# EAGLE design MetaSenseV02.1 (EAGLE 7.5.0)
MetaSense AQI Sensing Platform (v2)
DESIGNER: Christine Chan
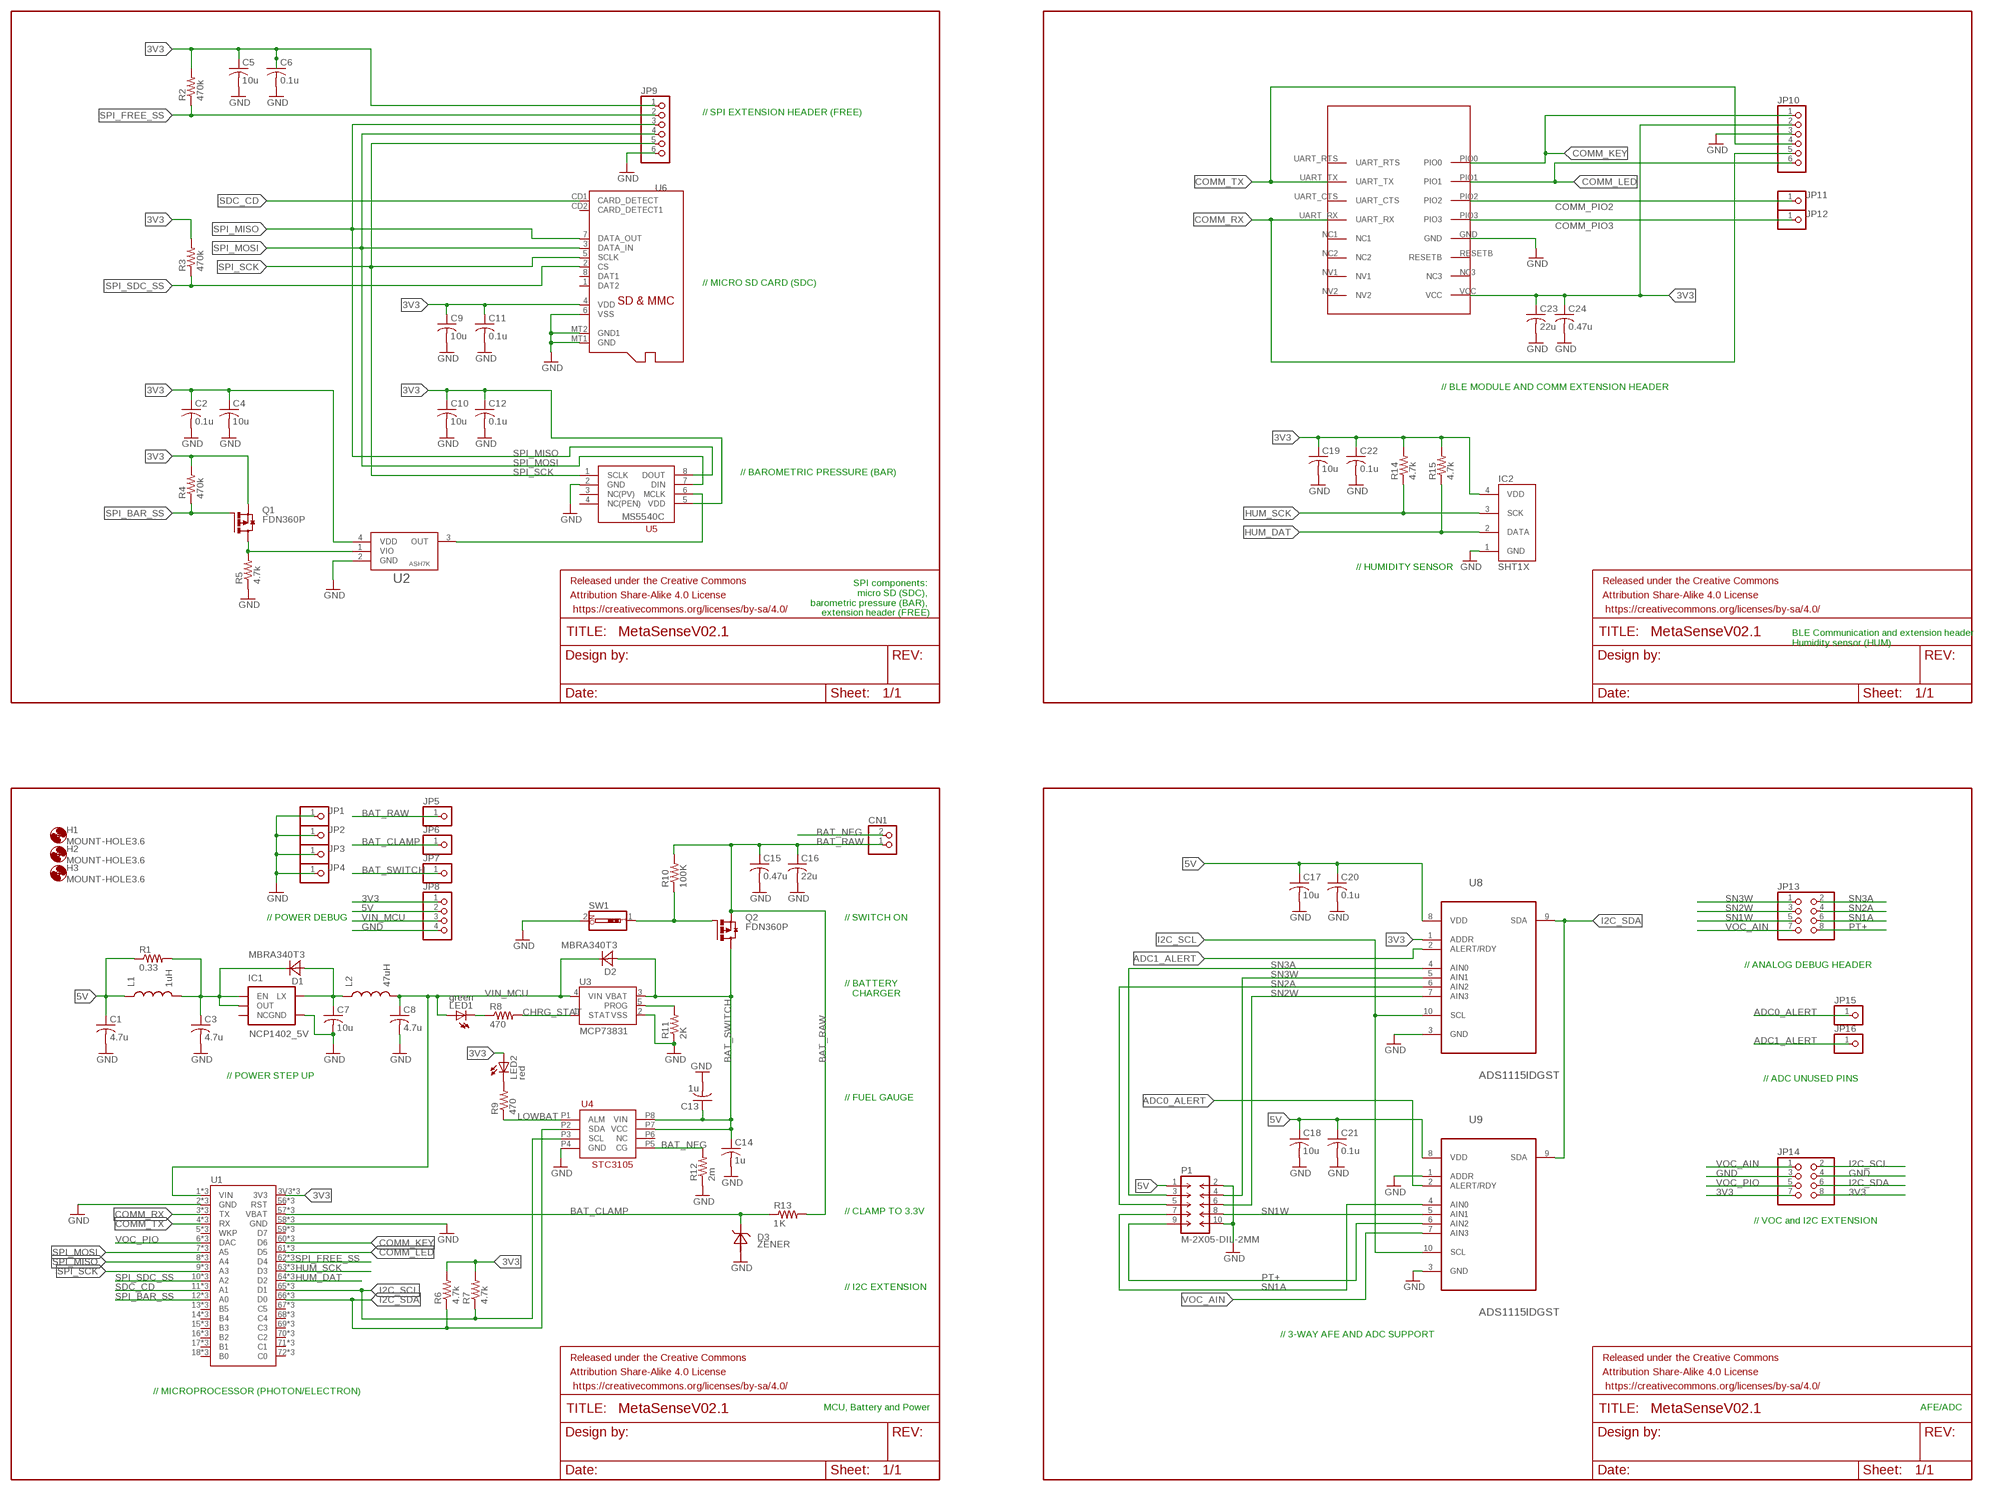
[diagram p0: schematic, sheet 1]

## Parts
C1  4.7u  C-USC0805  [C0805]
C2  0.1u  C-USC0805  [C0805]
C3  4.7u  C-USC0805  [C0805]
C4  10u  C-USC0805  [C0805]
C5  10u  C-USC0805  [C0805]
C6  0.1u  C-USC0805  [C0805]
C7  10u  C-USC0805  [C0805]
C8  4.7u  C-USC0805  [C0805]
C9  10u  C-USC0805  [C0805]
C10  10u  C-USC0805  [C0805]
C11  0.1u  C-USC0805  [C0805]
C12  0.1u  C-USC0805  [C0805]
C13  1u  C-USC0805  [C0805]
C14  1u  C-USC0805  [C0805]
C15  0.47u  C-USC0805  [C0805]
C16  22u  C-USC0805  [C0805]
C17  10u  C-USC0805  [C0805]
C18  10u  C-USC0805  [C0805]
C19  10u  C-USC0805  [C0805]
C20  0.1u  C-USC0805  [C0805]
C21  0.1u  C-USC0805  [C0805]
C22  0.1u  C-USC0805  [C0805]
C23  22u  C-USC0805  [C0805]
C24  0.47u  C-USC0805  [C0805]
CN1  JST_2PIN-THM  [JST-PH-2-THM]
D1  MBRA340T3  [SMA]
D2  MBRA340T3  [SMA]
D3  ZENER  [SOD-123_MINI-SMA]
FRAME1  FRAME-LETTER  [CREATIVE_COMMONS]
FRAME2  FRAME-LETTER  [CREATIVE_COMMONS]
FRAME3  FRAME-LETTER  [CREATIVE_COMMONS]
FRAME4  FRAME-LETTERNO_PACKAGE  [DUMMY]
H1  MOUNT-HOLE3.6  [3,6]
H2  MOUNT-HOLE3.6  [3,6]
H3  MOUNT-HOLE3.6  [3,6]
IC1  NCP1402_5V  V_REG_NCP1400_5V  [SOT23-5]
IC2  SHT1X  [SHT1X]
JP1  PINHD-1X1  [1X01]
JP2  PINHD-1X1  [1X01]
JP3  PINHD-1X1  [1X01]
JP4  PINHD-1X1  [1X01]
JP5  PINHD-1X1  [1X01]
JP6  PINHD-1X1  [1X01]
JP7  PINHD-1X1  [1X01]
JP8  PINHD-1X4  [1X04]
JP9  PINHD-1X6  [1X06]
JP10  PINHD-1X6  [1X06]
JP11  PINHD-1X1  [1X01]
JP12  PINHD-1X1  [1X01]
JP13  PINHD-2X4  [2X04]
JP14  PINHD-2X4  [2X04]
JP15  PINHD-1X1  [1X01]
JP16  PINHD-1X1  [1X01]
L1  1uH  INDUCTOR0805  [0805]
L2  47uH  INDUCTOR0805  [0805]
LED1  green  LEDCHIPLED_0805  [CHIPLED_0805]
LED2  red  LEDCHIPLED_0805  [CHIPLED_0805]
P1  M-2X05-DIL-2MM  [DIL-2MM-2X05]
Q1  FDN360P  [SUPER-SOT3]
Q2  FDN360P  [SUPER-SOT3]
R1  0.33  R-US_R0805  [R0805]
R2  470k  R-US_R0805  [R0805]
R3  470k  R-US_R0805  [R0805]
R4  470k  R-US_R0805  [R0805]
R5  4.7k  R-US_R0805  [R0805]
R6  4.7k  R-US_R0805  [R0805]
R7  4.7k  R-US_R0805  [R0805]
R8  470  R-US_R0805  [R0805]
R9  470  R-US_R0805  [R0805]
R10  100K  R-US_R0805  [R0805]
R11  2K  R-US_R0805  [R0805]
R12  2m  R-US_R0805  [R0805]
R13  1K  R-US_R0805  [R0805]
R14  4.7k  R-US_R0805  [R0805]
R15  4.7k  R-US_R0805  [R0805]
SW1  SW_DIP-1  [EDG-01]
U1  ELECTRONDUALROW  [ELECTRON_DUAL-ROW]
U2  ASH7K-OSCILLATOR  [SMD-4PAD]
U3  MCP73831  [SOT23-5]
U4  STC3105  [TDFN-8-3X2MM]
U5  MS5540CSMD  [SMD-HYBRID]
U6  MICROSD  [MICROSD]
U7  HM-11  [HM-11]
U8  ADS1115IDGST  [SOP50P490X110-10N]
U9  ADS1115IDGST  [SOP50P490X110-10N]

## Nets
3V3: C2.1 C4.1 C5.1 C6.1 C9.1 C10.1 C11.1 C12.1 C19.1 C22.1 C23.1 C24.1 IC2.4(VDD) JP8.1 JP9.1 JP10.2 JP14.7 JP14.8 LED2.A Q1.2(S) R2.2 R3.2 R4.2 R6.2 R7.2 R14.2 R15.2 U1.3V3 U1.55(3V3) U1.91(3V3) U2.4(VDD) U5.5(VDD) U6.4(VDD) U7.VCC U8.1(ADDR)
5V: C1.1 C17.1 C18.1 C20.1 C21.1 JP8.2 L1.1 P1.1 R1.1 U8.8(VDD) U9.8(VDD)
ADC0_ALERT: JP15.1 U9.2(ALERT/RDY)
ADC1_ALERT: JP16.1 U8.2(ALERT/RDY)
BAT_CLAMP: D3.C(CAT) JP6.1 R13.1 U1.57(VBAT) U1.93(VBAT) U1.VBAT
BAT_NEG: CN1.2 R12.2 U4.P5(CG)
BAT_RAW: C15.1 C16.1 CN1.1 JP5.1 Q2.2(S) R10.2 R13.2
BAT_SWITCH: C13.1 C14.1 D2.A JP7.1 Q2.3(D) U3.3(VBAT) U4.P7(VCC) U4.P8(VIN)
CHRG_STAT: R8.2 U3.1(STAT)
COMM_KEY: JP10.1 U1.60(D6) U1.96(D6) U1.D6 U7.PIO0
COMM_LED: JP10.6 U1.61(D5) U1.97(D5) U1.D5 U7.PIO1
COMM_PIO2: JP11.1 U7.PIO2
COMM_PIO3: JP12.1 U7.PIO3
COMM_RX: JP10.5 U1.3(TX) U1.39(TX) U1.TX U7.UART_RX
COMM_TX: JP10.4 U1.4(RX) U1.40(RX) U1.RX U7.UART_TX
GND: C1.2 C2.2 C3.2 C4.2 C5.2 C6.2 C7.2 C8.2 C9.2 C10.2 C11.2 C12.2 C13.2 C14.2 C15.2 C16.2 C17.2 C18.2 C19.2 C20.2 C21.2 C22.2 C23.2 C24.2 D3.A(AN) IC1.4(GND) IC2.1(GND) JP1.1 JP2.1 JP3.1 JP4.1 JP8.4 JP9.6 JP10.3 JP14.3 JP14.4 P1.2 P1.10 R5.1 R11.1 R12.1 SW1.2 U1.2(GND) U1.38(GND) U1.58(GND) U1.94(GND) U1.GND U1.GND@2(GND) U2.2(GND) U3.2(VSS) U4.P4(GND) U5.2(GND) U6.6(VSS) U6.MT1(GND) U6.MT2(GND1) U7.GND U8.3(GND) U9.1(ADDR) U9.3(GND)
HUM_DAT: IC2.2(DATA) R15.1 U1.64(D2) U1.100(D2) U1.D2
HUM_SCK: IC2.3(SCK) R14.1 U1.63(D3) U1.99(D3) U1.D3
I2C_SCL: JP14.2 R7.1 U1.65(D1) U1.101(D1) U1.D1 U4.P3(SCL) U8.10(SCL) U9.10(SCL)
I2C_SDA: JP14.6 R6.1 U1.66(D0) U1.102(D0) U1.D0 U4.P2(SDA) U8.9(SDA) U9.9(SDA)
LOWBAT: R9.1 U4.P1(ALM)
N$1: Q1.3(D) R5.2 U2.1(VIO)
N$2: C3.1 D1.C IC1.1(EN) IC1.2(OUT) L1.2 R1.2
N$3: LED2.C R9.2
N$5: C7.1 D1.A IC1.5(LX) L2.1
N$9: R11.2 U3.5(PROG)
N$11: LED1.C R8.1
N$12: Q2.1(G) R10.1 SW1.1
N$16: U2.3(OUT) U5.6(MCLK)
PT+: JP13.8 P1.9 U9.6(AIN2)
SDC_CD: U1.11(A1) U1.47(A1) U1.A1 U6.CD1(CARD_DETECT)
SN1A: JP13.6 P1.7 U9.4(AIN0)
SN1W: JP13.5 P1.8 U9.5(AIN1)
SN2A: JP13.4 P1.5 U8.6(AIN2)
SN2W: JP13.3 P1.6 U8.7(AIN3)
SN3A: JP13.2 P1.3 U8.4(AIN0)
SN3W: JP13.1 P1.4 U8.5(AIN1)
SPI_BAR_SS: Q1.1(G) R4.1 U1.12(A0) U1.48(A0) U1.A0
SPI_FREE_SS: JP9.2 R2.1 U1.62(D4) U1.98(D4) U1.D4
SPI_MISO: JP9.3 U1.8(A4) U1.44(A4) U1.A4 U5.8(DOUT) U6.7(DATA_OUT)
SPI_MOSI: JP9.4 U1.7(A5) U1.43(A5) U1.A5 U5.7(DIN) U6.3(DATA_IN)
SPI_SCK: JP9.5 U1.9(A3) U1.45(A3) U1.A3 U5.1(SCLK) U6.5(SCLK)
SPI_SDC_SS: R3.1 U1.10(A2) U1.46(A2) U1.A2 U6.2(CS)
VIN_MCU: C8.1 D2.C JP8.3 L2.2 LED1.A U1.1(VIN) U1.37(VIN) U1.VIN U3.4(VIN)
VOC_AIN: JP13.7 JP14.1 U9.7(AIN3)
VOC_PIO: JP14.5 U1.6(DAC) U1.42(DAC) U1.DAC
Unconnected: IC1.3(NC) U1.5(WKP) U1.13(B5) U1.14(B4) U1.15(B3) U1.16(B2) U1.17(B1) U1.18(B0) U1.41(WKP) U1.49(B5) U1.50(B4) U1.51(B3) U1.52(B2) U1.53(B1) U1.54(B0) U1.56(RST) U1.59(D7) U1.67(C5) U1.68(C4) U1.69(C3) U1.70(C2) U1.71(C1) U1.72(C0) U1.92(RST) U1.95(D7) U1.103(C5) U1.104(C4) U1.105(C3) U1.106(C2) U1.107(C1) U1.108(C0) U1.B0 U1.B1 U1.B2 U1.B3 U1.B4 U1.B5 U1.C0 U1.C1 U1.C2 U1.C3 U1.C4 U1.C5 U1.D7 U1.RST U1.WKP U4.P6(NC) U5.3(NC(PV)) U5.4(NC(PEN)) U6.1(DAT2) U6.8(DAT1) U6.CD2(CARD_DETECT1) U7.NC1 U7.NC2 U7.NC3 U7.NV1 U7.NV2 U7.RESETB U7.UART_CTS U7.UART_RTS

## Notes on the sheet
- // SPI EXTENSION HEADER (FREE)
- // MICRO SD CARD (SDC)
- // BLE MODULE AND COMM EXTENSION HEADER
- // BAROMETRIC PRESSURE (BAR)
- // HUMIDITY SENSOR
- SPI components: 
  micro SD (SDC), 
  barometric pressure (BAR), 
  extension header (FREE)
- BLE Communication and extension header
  Humidity sensor (HUM)
- // POWER DEBUG | // SWITCH ON
- // ANALOG DEBUG HEADER
- // BATTERY 
     CHARGER
- // POWER STEP UP
- // ADC UNUSED PINS
- // FUEL GAUGE
- // CLAMP TO 3.3V
- // VOC and I2C EXTENSION
- // I2C EXTENSION
- // 3-WAY AFE AND ADC SUPPORT
- // MICROPROCESSOR (PHOTON/ELECTRON)
- MCU, Battery and Power | AFE/ADC

## Library data of the parts
C1 C3 C8 = adafruit:C-US: CAPACITOR, American symbol; MF: VISHAY/DALE; MPN: IHLP2525CZER4R7M01; OC_NEWARK: 53K4859
C2 C6 C11 C12 C20-C22 = adafruit:C-US: CAPACITOR, American symbol; MF: KEMET; MPN: C0603C102J5GACTU; OC_NEWARK: 02J8136
C4 C5 C7 C9 C10 C17-C19 = adafruit:C-US: CAPACITOR, American symbol; MPN: C0805C106Z8VACTU; OC_NEWARK: 76Y2954
C13-C15 C24 = adafruit:C-US: CAPACITOR, American symbol; MF: KEMET; MPN: C0402C471K5RACTU; OC_NEWARK: 88C9981
C16 C23 = adafruit:C-US: CAPACITOR, American symbol; OC_NEWARK: unknown
CN1 = adafruit:JST_2PIN: JST 2-Pin Connectors of various flavors SMT-RA (S2B-PH-SM4) 4UConnector #17311 SMT (B2B-PH-SM4) THM-RA (S2B-PH) THM (B2B-PH); OC_NEWARK: unknown
D1 D2 = diode:MBRA340T3: Surface Mount Schottky Power Rectifier Source: http://www.onsemi.com/pub_link/Collateral/MBRA340T3-D.PDF; OC_NEWARK: unknown
D3 = metasense:ZENER; OC_NEWARK: unknown
FRAME1-FRAME3 = SparkFun-Aesthetics:FRAME-LETTER: Schematic Frame Standard 8.5x11 US Letter frame; OC_NEWARK: unknown
FRAME4 = SparkFun-Aesthetics:FRAME-LETTER: Schematic Frame Standard 8.5x11 US Letter frame; DESIGNER: Christine Chan; OC_NEWARK: unknown; VERSION: v02
H1-H3 = holes:MOUNT-HOLE: MOUNTING HOLE with drill center marker; OC_NEWARK: unknown
IC1 = SparkFun-PowerIC:V_REG_NCP1400: Switching step-up voltage regulator NCP1400 switiching regulator takes single cell AA and outputs 100mA at 3.3V or 5V with minimal number of external components.; MF: ON SEMICONDUCTOR; MPN: NCP1402SN50T1G; OC_NEWARK: 98H0882; PROD_ID: IC-10787; VALUE: 5.0v
IC2 = sht10_11_15:SHT1X; MF: SENSIRION AG; MPN: SHT11; OC_NEWARK: 69C4848
JP1-JP7 JP11 JP12 = pinhead:PINHD-1X1: PIN HEADER; OC_NEWARK: unknown
JP8 = pinhead:PINHD-1X4: PIN HEADER; OC_NEWARK: unknown
JP9 JP10 = adafruit:PINHD-1X6: PIN HEADER; OC_NEWARK: unknown
JP13 JP14 = adafruit:PINHD-2X4: PIN HEADER; OC_NEWARK: unknown
JP15 JP16 = adafruit:PINHD-1X1: Pin header 1x1 for 0.1" spacing With round pins; OC_NEWARK: unknown
L1 = SparkFun-Passives:INDUCTOR: Inductors Basic Inductor/Choke - 0603 and 1206. Footprints are not proven and vary greatly between part numbers. INDUCTOR POWER 3.3UH 4.0A SMD 0.197" L x 0.197" W x 0.177" H (5.00mm x 5.00mm x 4.50mm); MPN: LQM21NN1R0K10D; OC_NEWARK: 97K3787
L2 = SparkFun-Passives:INDUCTOR: Inductors Basic Inductor/Choke - 0603 and 1206. Footprints are not proven and vary greatly between part numbers. INDUCTOR POWER 3.3UH 4.0A SMD 0.197" L x 0.197" W x 0.177" H (5.00mm x 5.00mm x 4.50mm); OC_NEWARK: unknown
LED1 = adafruit:LED: LED OSRAM: - CHIPLED LG R971, LG N971, LY N971, LG Q971, LY Q971, LO R971, LY R971 LH N974, LH R974 LS Q976, LO Q976, LY Q976 LO Q996 - Hyper CHIPLED LW Q18S LB Q993, LB Q99A, LB R99A - SideLED LS A670, LO A670, LY A670, LG A670, LP A670 LB A673, LV A673, LT A673, LW A673 LH A674 LY A675 LS A676, LA A676, LO A676, LY A676, LW A676 LS A679, LY A679, LG A679 - Hyper Micro SIDELED® LS Y876, LA Y876, LO Y876, LY Y876 LT Y87S - SmartLED LW L88C, LW L88S LB L89C, LB L89S, LG L890 LS L89K, LO L89K, LY L89K LS L896, LA L896, LO L896, LY L896 - TOPLED LS T670, LO T670, LY T670, LG T670, LP T670 LSG T670, LSP T670, LSY T670, LOP T670, LYG T670 LG T671, LOG T671, LSG T671 LB T673, LV T673, LT T673, LW T673 LH T674 LS T676, LA T676, LO T676, LY T676, LB T676, LH T676, LSB T676, LW T676 LB T67C, LV T67C, LT T67C, LS T67K, LO T67K, LY T67K, LW E67C LS E67B, LA E67B, LO E67B, LY E67B, LB E67C, LV E67C, LT E67C LW T67C LS T679, LY T679, LG T679 LS T770, LO T770, LY T770, LG T770, LP T770 LB T773, LV T773, LT T773, LW T773 LH T774 LS E675, LA E675, LY E675, LS T675 LS T776, LA T776, LO T776, LY T776, LB T776 LHGB T686 LT T68C, LB T68C - Hyper Mini TOPLED® LB M676 - Mini TOPLED Santana® LG M470 LS M47K, LO M47K, LY M47K Source: http://www.osram.convergy.de/; MPN: NTE30003; OC_NEWARK: 32M3086
LED2 = adafruit:LED: LED OSRAM: - CHIPLED LG R971, LG N971, LY N971, LG Q971, LY Q971, LO R971, LY R971 LH N974, LH R974 LS Q976, LO Q976, LY Q976 LO Q996 - Hyper CHIPLED LW Q18S LB Q993, LB Q99A, LB R99A - SideLED LS A670, LO A670, LY A670, LG A670, LP A670 LB A673, LV A673, LT A673, LW A673 LH A674 LY A675 LS A676, LA A676, LO A676, LY A676, LW A676 LS A679, LY A679, LG A679 - Hyper Micro SIDELED® LS Y876, LA Y876, LO Y876, LY Y876 LT Y87S - SmartLED LW L88C, LW L88S LB L89C, LB L89S, LG L890 LS L89K, LO L89K, LY L89K LS L896, LA L896, LO L896, LY L896 - TOPLED LS T670, LO T670, LY T670, LG T670, LP T670 LSG T670, LSP T670, LSY T670, LOP T670, LYG T670 LG T671, LOG T671, LSG T671 LB T673, LV T673, LT T673, LW T673 LH T674 LS T676, LA T676, LO T676, LY T676, LB T676, LH T676, LSB T676, LW T676 LB T67C, LV T67C, LT T67C, LS T67K, LO T67K, LY T67K, LW E67C LS E67B, LA E67B, LO E67B, LY E67B, LB E67C, LV E67C, LT E67C LW T67C LS T679, LY T679, LG T679 LS T770, LO T770, LY T770, LG T770, LP T770 LB T773, LV T773, LT T773, LW T773 LH T774 LS E675, LA E675, LY E675, LS T675 LS T776, LA T776, LO T776, LY T776, LB T776 LHGB T686 LT T68C, LB T68C - Hyper Mini TOPLED® LB M676 - Mini TOPLED Santana® LG M470 LS M47K, LO M47K, LY M47K Source: http://www.osram.convergy.de/; MPN: NTE30002; OC_NEWARK: 32M3085
P1 = con-headers-jp:M-2X05-: MALE HEADER; OC_NEWARK: unknown
Q1 Q2 = transistor-power:FDN360P: Single P-Channel, PowerTrench (R) MOSFET Source: http://www.fairchildsemi.com/ds/FD/FDN360P.pdf; MF: FAIRCHILD SEMICONDUCTOR; MPN: FDN360P; OC_NEWARK: 58K1466
R1 R8 R9 R11 R12 = adafruit:R-US_: RESISTOR, American symbol; OC_NEWARK: unknown
R2-R4 = adafruit:R-US_: RESISTOR, American symbol; MF: VISHAY/DALE; MPN: CRCW0805470KJNEA; OC_NEWARK: 28K0214
R5-R7 R14 R15 = adafruit:R-US_: RESISTOR, American symbol; MF: VISHAY/DALE; MPN: CRCW08054K70JNEA; OC_NEWARK: 01H7096
R10 = adafruit:R-US_: RESISTOR, American symbol; MPN: ERA-6AEB104V; OC_NEWARK: 08N2143
R13 = adafruit:R-US_: RESISTOR, American symbol; MPN: ERJ-6ENF1001V; OC_NEWARK: 64R5369
SW1 = special:SW_DIP-1: DIP SWITCH; OC_NEWARK: unknown
U1 = Particle:ELECTRON; OC_NEWARK: unknown
U2 = metasense:ASH7K-OSCILLATOR; OC_NEWARK: unknown
U3 = SparkFun-PowerIC:MCP73831: Miniature single cell, fully integrated Li-Ion, Li-polymer charge management controller http://ww1.microchip.com/downloads/en/DeviceDoc/20001984g.pdf IC-09995; MPN: MCP73831T-2DCI/OT; OC_NEWARK: 84R6271; PROD_ID: IC-09995
U4 = metasense:STC3105
U5 = metasense:MS5540C; OC_NEWARK: unknown
U6 = metasense:MICROSD: Micro-SD / Transflash card holder with SPI pinout For the 3M # 2908-05WB-MG and/or 4UCON #19656 push-push type; MPN: 2908-05WB-MG; OC_NEWARK: 28M0115
U7 = HM-11:HM-11; OC_NEWARK: unknown
U8 U9 = Texas Instruments_By_element14_Batch_1:ADS1115IDGST: Analog-to-Digital Converter with Internal Reference; MPN: ADS1115IDGST; OC_FARNELL: 1762981; OC_NEWARK: 25R1241; PACKAGE: MSOP-10; SUPPLIER: Texas Instruments

## Board
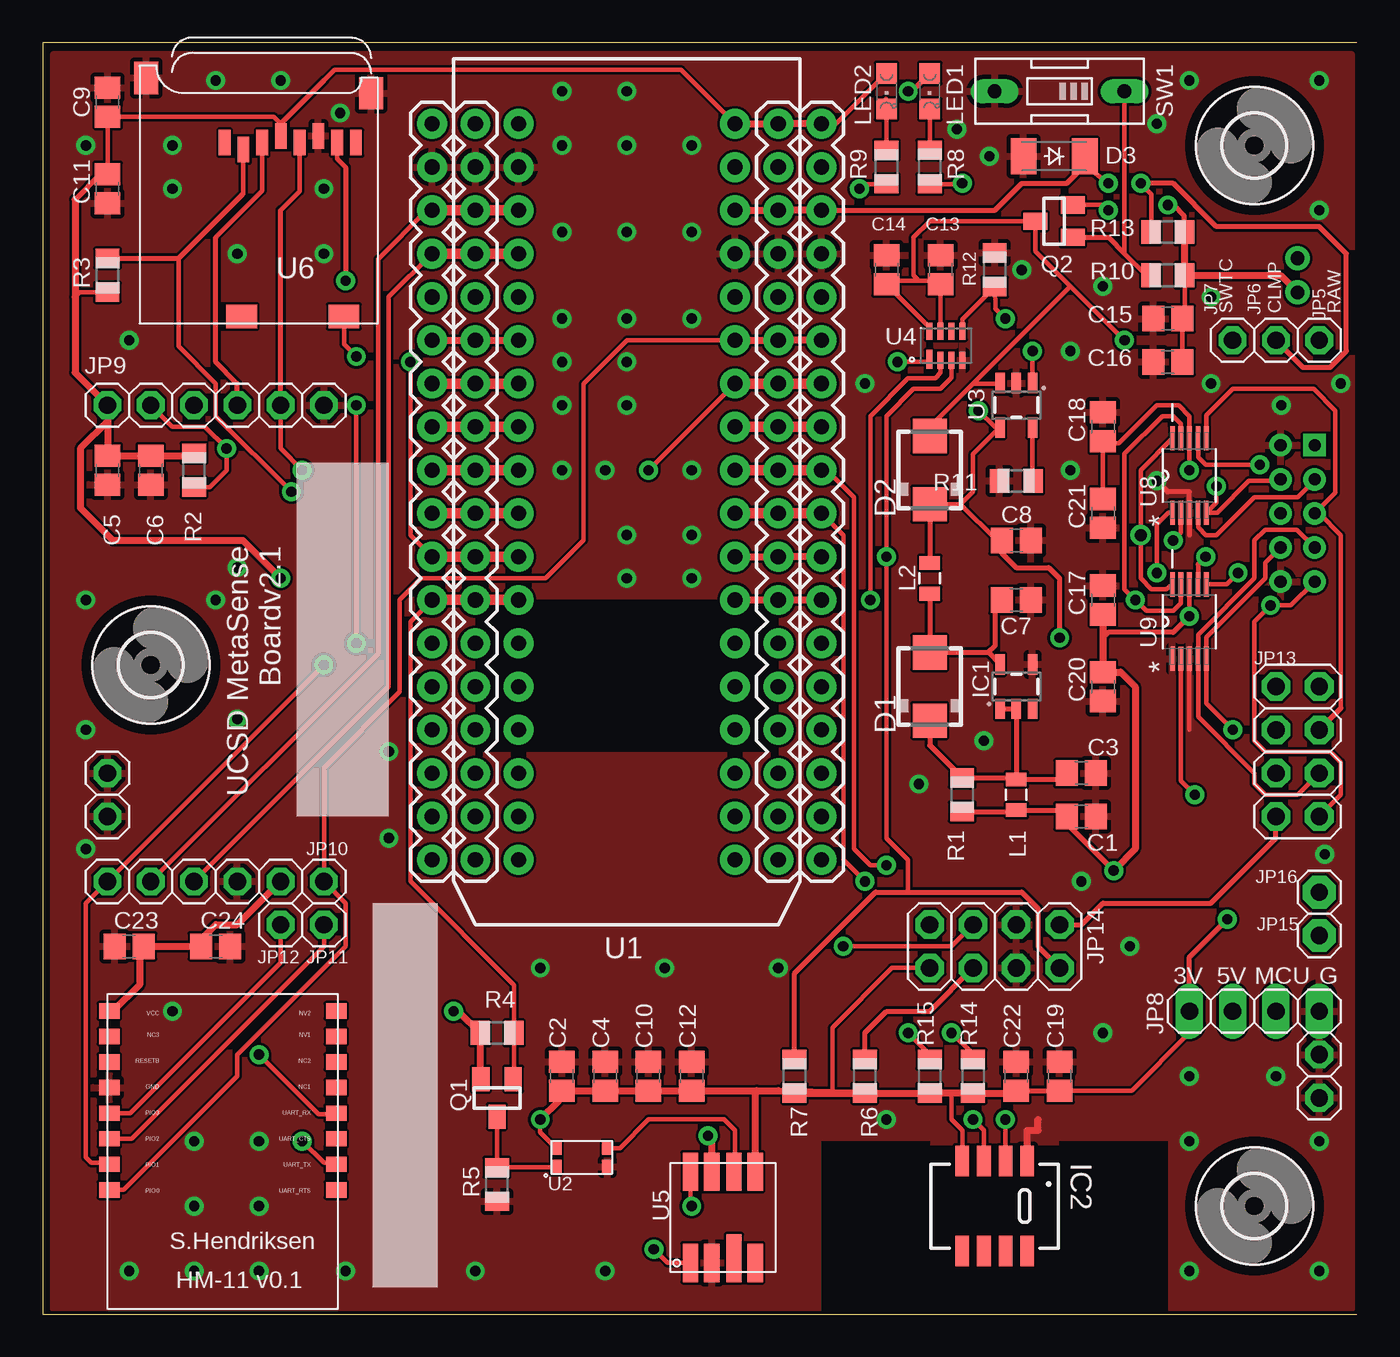
[diagram p1: board, top side]
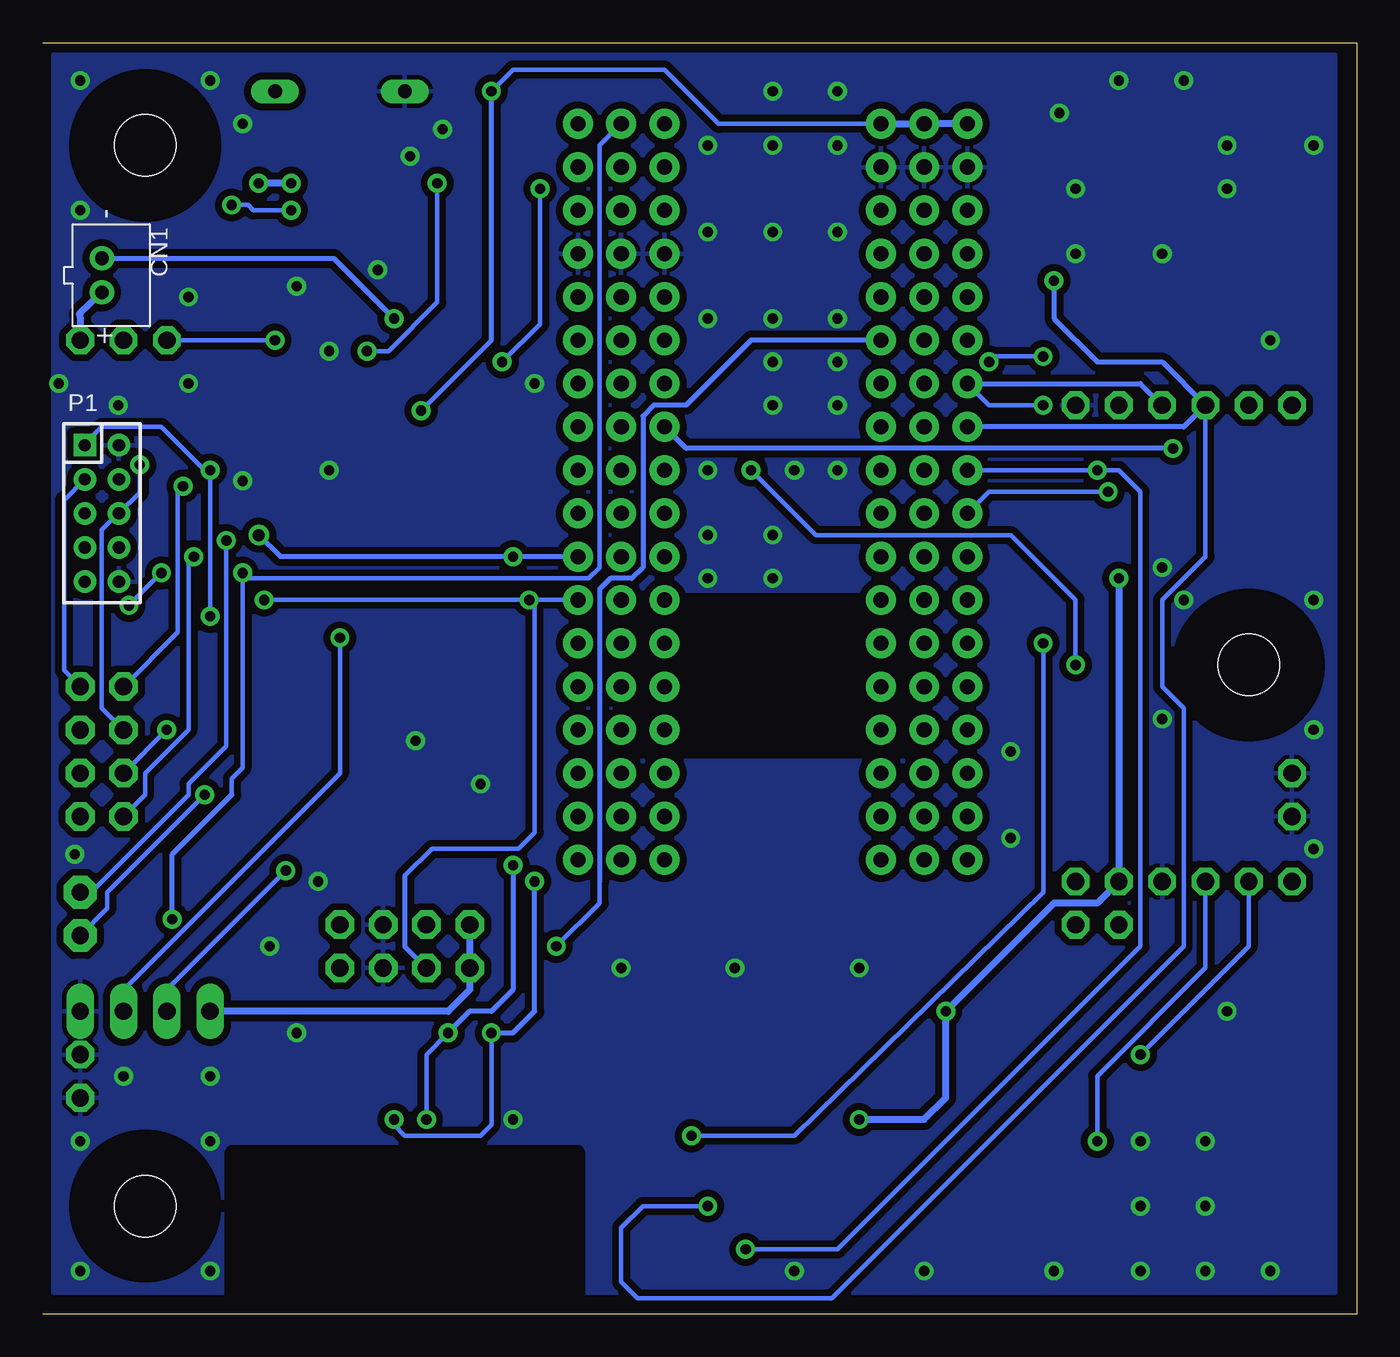
[diagram p2: board, bottom side, seen from below]

Size 77.14 x 74.61 mm. Coordinates in mm from the lower left corner, seen from the top.
Outline: 77.14,0 0,0 0,74.61 77.14,74.6
Copper layers (1*16): Top 0.035mm / dielectric 1.5mm / Bottom 0.035mm
Design rules "SparkFun *": minimum track width 8mil, minimum drill 20mil, track to track 6mil, track to pad 7mil, pad to pad 7mil, via to via 6mil, smd to smd 6mil, copper to edge 8mil, drill to drill 8mil, minimum pad ring 12mil, minimum via ring 10mil, stop-mask expansion 6mil, vias tented up to drill 20mil, thermal gap 10mil
tRestrict: area 25.4,33 to 43.2,41.9; area 45.7,-1.3 to 52.1,10.2; area 59.7,-1.3 to 66,10.2; area 45.7,-1.3 to 66,2.5
bRestrict: area 25.4,33 to 43.2,41.9; area 45.7,0.6 to 66,9.5

### Footprints (pad centres in the part's own frame; a part is rotated, then mirrored left to right if it is on the bottom)
C0805 = smd 1.3 x 1.5: 1 -0.85,0; 2 0.85,0
JST-PH-2-THM = drill 0.8 pad 1.422: 1 1,0; 2 -1,0
SMA = smd 2 x 2: A 2,0; C -2,0
SOD-123_MINI-SMA = smd 1.5 x 2.1: A 1.8,0; C -1.8,0
3,6 = hole 3.6: 0,0
SOT23-5 = smd 0.55 x 1.2: 1 -0.95,-1.3; 2 0,-1.3; 3 0.95,-1.3; 4 0.95,1.3; 5 -0.95,1.3
SHT1X = smd 1.803 x 0.8: 1 -2.642,1.905; 2 -2.642,0.635; 3 -2.642,-0.635; 4 -2.642,-1.905; 5 2.642,-1.905; 6 2.642,-0.635; 7 2.642,0.635; 8 2.642,1.905
1X01 = drill 1.016 octagon: 1 0,0
1X04 = drill 1.016 long: 1 -3.81,0; 2 -1.27,0; 3 1.27,0; 4 3.81,0
1X06 = drill 1.016 octagon: 1 -6.35,0; 2 -3.81,0; 3 -1.27,0; 4 1.27,0; 5 3.81,0; 6 6.35,0
2X04 = drill 1.016 pad 1.676 octagon: 1 -3.81,-1.27; 2 -3.81,1.27; 3 -1.27,-1.27; 4 -1.27,1.27; 5 1.27,-1.27; 6 1.27,1.27; 7 3.81,-1.27; 8 3.81,1.27
1X01' = drill 1.016 pad 1.93 octagon: 1 0,0
0805 = smd 0.8 x 1.2: 1 -0.9,0; 2 0.9,0
CHIPLED_0805 = smd 1.2 x 1.2: A 0,-1.05; C 0,1.05
DIL-2MM-2X05 = drill 0.711 square: 1 -4,-1 | drill 0.711: 2 -4,1; 3 -2,-1; 4 -2,1; 5 0,-1; 6 0,1; 7 2,-1; 8 2,1; 9 4,-1; 10 4,1
SUPER-SOT3 = smd 1 x 1.4: 1 -0.95,-1.1; 2 0.95,-1.1; 3 0,1.1
R0805 = smd 1.1 x 1.4: 1 -1,0; 2 1,0
EDG-01 = drill 0.813 long: 1 0,-3.81; 2 0,3.81
ELECTRON_DUAL-ROW = drill 0.889 pad 1.753: 1 1.27,2.54; 2 3.81,2.54; 3 6.35,2.54; 3V3 1.27,22.86; 4 8.89,2.54; 5 11.43,2.54; 6 13.97,2.54; 7 16.51,2.54; 8 19.05,2.54; 9 21.59,2.54; 10 24.13,2.54; 11 26.67,2.54; 12 29.21,2.54; 13 31.75,2.54; 14 34.29,2.54; 15 36.83,2.54; 16 39.37,2.54; 17 41.91,2.54; 18 44.45,2.54; 37 1.27,7.62; 38 3.81,7.62; 39 6.35,7.62; 40 8.89,7.62; 41 11.43,7.62; 42 13.97,7.62; 43 16.51,7.62; 44 19.05,7.62; 45 21.59,7.62; 46 24.13,7.62; 47 26.67,7.62; 48 29.21,7.62; 49 31.75,7.62; 50 34.29,7.62; 51 36.83,7.62; 52 39.37,7.62; 53 41.91,7.62; 54 44.45,7.62; 55 1.27,20.32; 56 3.81,20.32; 57 6.35,20.32; 58 8.89,20.32; 59 11.43,20.32; 60 13.97,20.32; 61 16.51,20.32; 62 19.05,20.32; 63 21.59,20.32; 64 24.13,20.32; 65 26.67,20.32; 66 29.21,20.32; 67 31.75,20.32; 68 34.29,20.32; 69 36.83,20.32; 70 39.37,20.32; 71 41.91,20.32; 72 44.45,20.32; 91 1.27,25.4; 92 3.81,25.4; 93 6.35,25.4; 94 8.89,25.4; 95 11.43,25.4; 96 13.97,25.4; 97 16.51,25.4; 98 19.05,25.4; 99 21.59,25.4; 100 24.13,25.4; 101 26.67,25.4; 102 29.21,25.4; 103 31.75,25.4; 104 34.29,25.4; 105 36.83,25.4; 106 39.37,25.4; 107 41.91,25.4; 108 44.45,25.4; A0 29.21,5.08; A1 26.67,5.08; A2 24.13,5.08; A3 21.59,5.08; A4 19.05,5.08; A5 16.51,5.08; B0 44.45,5.08; B1 41.91,5.08; B2 39.37,5.08; B3 36.83,5.08; B4 34.29,5.08; B5 31.75,5.08; C0 44.45,22.86; C1 41.91,22.86; C2 39.37,22.86; C3 36.83,22.86; C4 34.29,22.86; C5 31.75,22.86; D0 29.21,22.86; D1 26.67,22.86; D2 24.13,22.86; D3 21.59,22.86; D4 19.05,22.86; D5 16.51,22.86; D6 13.97,22.86; D7 11.43,22.86; DAC 13.97,5.08; GND 8.89,22.86; GND@2 3.81,5.08; RST 3.81,22.86; RX 8.89,5.08; TX 6.35,5.08; VBAT 6.35,22.86; VIN 1.27,5.08; WKP 11.43,5.08
SMD-4PAD = smd 0.6 x 0.8: 1 0.3,0.4; 2 3.3,0.4; 3 3.3,1.5; 4 0.3,1.5
TDFN-8-3X2MM = smd 0.35 x 1.1: P1 -0.975,-0.8 | smd 0.35 x 1: P2 -0.325,-0.85; P3 0.325,-0.85; P4 0.975,-0.85; P5 0.975,0.85; P6 0.325,0.85; P7 -0.325,0.85; P8 -0.975,0.85
SMD-HYBRID = smd 2.25 x 0.9: 1 5.875,1.2; 2 5.875,2.45; 4 5.875,5; 5 0.525,5; 6 0.525,3.75; 7 0.525,2.45; 8 0.525,1.2 | smd 2.8 x 0.9: 3 5.6,3.75
MICROSD = smd 0.7 x 1.5: 1 9,-10.64; 2 7.9,-10.24; 3 6.8,-10.64; 4 5.7,-11.04; 5 4.6,-10.64; 6 3.5,-11.04; 7 2.4,-10.64; 8 1.3,-10.64 | smd 1.8 x 1.4: CD1 2,-0.44; CD2 8,-0.44 | smd 1.4 x 1.9: MT1 0.4,-13.54; MT2 13.6,-14.44
HM-11 = smd 1.2 x 0.9: GND 7.508,-0.6; NC1 -5.808,-0.6; NC2 -5.808,-2.1; NC3 7.508,-3.6; NV1 -5.808,-3.6; NV2 -5.808,-5.1; PIO0 7.508,5.4; PIO1 7.508,3.9; PIO2 7.508,2.4; PIO3 7.508,0.9; RESETB 7.508,-2.1; UART_CTS -5.808,2.4; UART_RTS -5.808,5.4; UART_RX -5.808,0.9; UART_TX -5.808,3.9; VCC 7.508,-5.1
SOP50P490X110-10N = smd 1.422 x 0.279: 1 -2.184,0.991; 2 -2.184,0.508; 3 -2.184,0; 4 -2.184,-0.508; 5 -2.184,-0.991; 6 2.184,-0.991; 7 2.184,-0.508; 8 2.184,0; 9 2.184,0.508; 10 2.184,0.991

### Placement (x,y rotation side)
C1  60.96,29.21 0 top
C2  30.48,13.97 90 top
C3  60.96,31.75 0 top
C4  33.02,13.97 90 top
C5  3.81,49.53 270 top
C6  6.35,49.53 270 top
C7  57.15,41.91 0 top
C8  57.15,45.4 0 top
C9  3.81,71.12 90 top
C10  35.56,13.97 90 top
C11  3.81,66.04 270 top
C12  38.1,13.97 90 top
C13  52.7,61.28 90 top
C14  49.53,61.28 90 top
C15  66.04,58.42 180 top
C16  66.04,55.88 180 top
C17  62.23,41.91 90 top
C18  62.23,52.07 90 top
C19  59.69,13.97 90 top
C20  62.23,36.83 270 top
C21  62.23,46.99 270 top
C22  57.15,13.97 90 top
C23  5.08,21.59 180 top
C24  10.16,21.59 0 top
CN1  73.66,60.96 270 bottom
D1  52.07,36.83 90 top
D2  52.07,49.53 90 top
D3  59.37,67.94 180 top
FRAME1  16.51,-12.7 0 top  (outside the outline)
FRAME2  16.51,-12.7 0 top  (outside the outline)
FRAME3  16.51,-12.7 0 top  (outside the outline)
FRAME4  2.54,-10.16 0 top  (outside the outline)
H1  71.12,68.58 0 top
H2  71.12,6.35 0 top
H3  6.35,38.1 0 top
IC1  57.15,36.83 0 top
IC2  55.88,6.35 270 top
JP1  3.81,31.75 0 top
JP2  3.81,29.21 0 top
JP3  74.93,15.24 0 top
JP4  74.93,12.7 0 top
JP5  74.93,57.15 0 top
JP6  72.39,57.15 0 top
JP7  69.85,57.15 0 top
JP8  71.12,17.78 0 top
JP9  10.16,53.34 0 top
JP10  10.16,25.4 180 top
JP11  16.51,22.86 0 top
JP12  13.97,22.86 0 top
JP13  73.66,33.02 270 top
JP14  55.88,21.59 180 top
JP15  [1X01']  74.93,22.23 0 top
JP16  [1X01']  74.93,24.77 0 top
L1  57.15,30.48 90 top
L2  52.07,43.18 90 top
LED1  52.07,71.75 180 top
LED2  49.53,71.75 180 top
P1  73.66,46.99 270 bottom
Q1  26.67,12.7 180 top
Q2  59.37,64.14 90 top
R1  53.98,30.48 90 top
R2  8.89,49.53 90 top
R3  3.81,60.96 270 top
R4  26.67,16.51 180 top
R5  26.67,7.62 90 top
R6  48.26,13.97 270 top
R7  44.13,13.97 270 top
R8  52.07,67.31 270 top
R9  49.53,67.31 90 top
R10  66.04,60.96 0 top
R11  57.15,48.9 0 top
R12  55.88,61.28 270 top
R13  66.04,63.5 0 top
R14  54.61,13.97 270 top
R15  52.07,13.97 270 top
SW1  59.69,71.75 90 top
U1  20.32,71.12 270 top
U2  29.84,8.26 0 top
U3  57.15,53.34 180 top
U4  53.02,56.83 0 top
U5  36.83,8.89 270 top
U6  19.68,58.1 180 top
U7  11.43,12.7 180 top
U8  67.31,49.21 90 top
U9  67.31,40.64 90 top

### Tracks (layer width: path | path; a pad name or v marks a point on that pad's centre or on a via)
3V3  (via drill 0.6)
  Top 0.254: 57.15,12.7 C22.1 57,12.97 | R3.2 2.17,59.96 1.91,59.69 | 8.74,50.38 R2.2 | 25.72,16.46 R4.2 25.7,16.69 | 30.28,13.03 C2.1 | IC2.4 53.98,10.79 53.34,11.43 53.34,12.97 | C19.1 63.92,13.12 67.31,16.51 JP8.1 | U8.1 66.08,47.03 65.41,46.35 v65.41,43.5 | v29.21,11.43 29.21,10.69 U2.4 | C11.1 C9.1 13.55,70.27 13.97,69.85 13.97,69.16 U6.4 | 16.51,72.39 17.14,73.03 37.47,73.03 U1.55 | JP14.8 49.85,20.32 46.35,16.83 46.35,13.02 | U1.91 46.58,69.85 LED2.A
  Top 0.305: C22.1 C19.1 | C11.1 3.39,66.89 1.91,65.41 | U6.4 13.98,69.86 16.51,72.39 | JP8.1 67.31,20.95 v69.53,23.18
  Top 0.406: 57,12.97 R14.2 53.34,12.97 R15.2 R7.2 R6.2 43.18,13.12 41.91,13.12 | 1.91,65.41 1.91,59.69 1.91,55.24 JP9.1 | JP9.1 C5.1 C6.1 8.74,50.38 | C2.1 C4.1 C10.1 C12.1 41.91,13.12 | Q1.2 25.72,16.46 | U1.55 U1.3V3 U1.91 | U7.VCC 4.15,17.8 5.71,19.37 5.71,21.38 C23.1 C24.1 9.31,22.01 10.16,22.86 11.43,22.86 JP10.2 | U5.5 41.83,13.04 41.91,13.12 | v24.13,17.78 24.4,17.78 R4.2 | 30.28,13.03 30.28,12.5 v29.21,11.43 | JP9.1 3.81,52.39 2.22,50.8 2.22,47.31 4.13,45.4 11.75,45.4 v13.97,43.18
  Bottom 0.254: 66.04,30.48 66.04,31.43 65.41,32.07 v65.41,43.5 65.09,43.18 45.09,43.18 44.45,43.81 44.45,68.58 U1.3V3
  Bottom 0.305: v69.53,23.18 69.53,26.99 66.04,30.48
  Bottom 0.406: JP10.2 15.24,24.13 17.78,24.13 v24.13,17.78 24.13,12.7 25.4,11.43 v29.21,11.43 | v13.97,43.18 13.97,25.72 14.29,25.4 | JP8.1 53.34,17.78 52.07,19.05 JP14.8 JP14.7
5V  (via drill 0.6)
  Top 0.254: C21.1 C18.1 62.33,51.12 63.18,51.12 65.41,53.34 66.67,53.34 67.31,52.7 U8.8 v67.31,49.53 | U9.8 v67.31,40.96
  Top 0.305: v67.31,40.96 66.36,40.01 62.55,40.01 62.23,39.69 | R1.1 57.05,29.48 L1.1 59.74,29.58 C1.1 60.11,28.79 v62.87,26.04
  Top 0.406: C17.1 62.23,39.69 C20.1 63.28,37.68 64.14,36.83 64.14,27.3 v62.87,26.04
  Bottom 0.254: P1.1 74.66,51.07 73.66,52.07 70.17,52.07 67.63,49.53 v67.31,49.53 v67.31,40.96 | JP8.2 69.85,19.05 v62.87,26.04
ADC0_ALERT  (via drill 0.6)
  Top 0.254: U9.2 66.8,31.3 v67.63,30.48
  Bottom 0.254: v67.63,30.48 73.34,24.77 73.34,23.81 JP15.1
ADC1_ALERT  (via drill 0.6)
  Top 0.254: U8.2 66.8,45.85 v66.36,45.4
  Bottom 0.254: v66.36,45.4 66.36,33.34 68.58,31.11 68.58,30.48 74.3,24.77 JP16.1
BAT_CLAMP  (via drill 0.6)
  Top 0.254: 64.77,63.77 R13.1 65.09,63.55 65.09,65.72 v64.45,66.36
  Top 0.305: U1.93 55.88,64.77 57.47,66.36 60.12,66.36 61.17,67.42 | D3.C 61.17,67.42 | 61.17,67.42 v62.55,66.36 | JP6.1 73.98,55.56 75.56,55.56 76.52,56.52 76.52,62.23 74.93,63.82 68.9,63.82 66.36,66.36 v64.45,66.36
  Top 0.406: U1.57 U1.VBAT U1.93
  Bottom 0.406: v62.55,66.36 v64.45,66.36
BAT_NEG  (via drill 0.6)
  Top 0.254: v56.52,58.42 55.93,59.01 R12.2 54,58.4 U4.P5
  Bottom 0.305: CN1.2 60.05,61.96 v56.52,58.42
BAT_RAW  (via drill 0.6)
  Top 0.254: C16.1 C15.1 67.04,58.57 R10.2 67.11,61.11 67.13,61.14 67.31,60.96 | Q2.2 62.23,65.08 v62.55,64.77
  Top 0.305: v66.04,65.09 66.36,65.09 66.99,64.45 66.99,63.55 R13.2
  Top 0.406: 67.13,61.14 67.04,61.14 R13.2 | 67.31,60.96 72.66,60.96 CN1.1
  Bottom 0.254: v62.55,64.77 64.77,64.77 65.09,65.09 v66.04,65.09
  Bottom 0.406: CN1.1 74.98,58.69 74.93,58.42 JP5.1
BAT_SWITCH  (via drill 0.6)
  Top 0.254: 60.33,60.33 58.27,62.38 Q2.3 52.07,64.14 51.12,63.18 51.12,60.96 51.44,60.64 | 60.33,60.33 v63.5,57.15 | D2.A 52.07,52.07 54.61,54.61 | 54.61,54.61 56.17,54.61 U3.3 | 54.61,54.61 60.33,60.33 | U4.P7 C13.1 53.12,60.64 51.44,60.64 | U4.P8 52.05,57.91 C14.1 49.74,60.64 51.44,60.64
  Bottom 0.254: JP7.1 v63.5,57.15
CHRG_STAT  (via drill 0.6)
  Top 0.254: R8.2 53.93,66.31 v53.98,66.36 | U3.1 58.1,55.56 v58.1,56.52
  Bottom 0.254: v58.1,56.52 56.83,56.52 53.98,59.37 v53.98,66.36
COMM_KEY
  Top 0.254: U7.PIO0 4.76,7.3 11.43,13.97 11.43,15.24 17.78,21.59 17.78,24.13 JP10.1 16.51,32.07 20.95,36.51 20.95,41.91 22.23,43.18 29.53,43.18 31.75,45.4 31.75,54.61 34.29,57.15 U1.60
  Top 0.406: U1.60 U1.D6 U1.96
COMM_LED  (via drill 0.6)
  Top 0.254: v16.51,38.1 JP10.6 2.54,24.13 2.54,9.21 2.86,8.89 3.83,8.89 U7.PIO1 | v35.56,49.53 U1.61
  Top 0.61: U1.61 U1.D5 U1.97
  Bottom 0.254: v16.51,38.1 16.51,41.91 20.32,45.72 31.75,45.72 v35.56,49.53
COMM_PIO2
  Top 0.254: U7.PIO2 5.22,10.3 16.51,21.59 JP11.1
  Top 0.406: 4.06,10.16 U7.PIO2
COMM_PIO3
  Top 0.254: U7.PIO3 5.13,11.8 13.97,20.64 JP12.1
COMM_RX  (via drill 0.6)
  Top 0.254: v12.7,15.24 16.19,11.75 17.19,11.75 U7.UART_RX | U1.3 22.54,64.77 19.68,61.91 19.68,38.73 JP10.5
  Top 0.61: U1.39 U1.TX U1.3
  Bottom 0.254: JP10.5 6.35,21.59 v12.7,15.24
COMM_TX  (via drill 0.6)
  Top 0.254: v15.24,10.16 16.51,8.89 17.15,8.89 U7.UART_TX | U1.4 20.32,59.69 20.32,36.83 JP10.4
  Top 0.61: U1.4 U1.RX U1.40
  Bottom 0.254: JP10.4 8.89,20.32 15.24,13.97 v15.24,10.16
GND  (via drill 0.6)
  Top 0.254: U9.3 67.31,34.29
  Top 0.305: 67.31,45.72 U8.3 67.31,48.26 66.04,48.26 v65.41,48.9
  Top 0.406: IC2.1 57.78,10.79 58.42,10.79 58.42,11.43
  other vias: 17.46,70.48 13.97,72.39 7.62,66.04 74.93,64.77 74.93,72.39 74.93,10.16 67.31,72.39 30.48,71.75 2.54,41.91 2.54,34.29 2.54,27.3 11.43,34.92 11.43,43.81 20.32,33.02 20.32,27.94 7.62,17.78 8.89,10.16 12.7,10.16 12.7,6.35 8.89,6.35 5.08,2.54 8.89,2.54 12.7,2.54 17.78,2.54 25.4,2.54 33.02,2.54 67.31,2.54 74.93,2.54 2.54,68.58 10.16,72.39 38.1,68.58 34.29,68.58 30.48,68.58 30.48,63.5 34.29,63.5 38.1,63.5 34.29,58.42 38.1,58.42 30.48,58.42 30.48,55.88 34.29,55.88 34.29,53.34 30.48,53.34 30.48,49.53 38.1,49.53 38.1,45.72 34.29,45.72 34.29,43.18 38.1,43.18 11.43,62.23 16.51,66.04 16.51,62.23 5.08,57.15 53.66,69.53 55.56,67.94 65.41,69.85 68.58,54.61 76.2,54.61 68.58,59.69 67.31,10.16 67.31,13.97 72.39,13.97 62.23,16.51 63.82,21.59 43.18,20.32 29.21,20.32 36.51,20.32 60.96,25.4 49.53,11.43 10.16,41.91 7.62,68.58 33.02,49.53 72.71,53.34 34.29,71.75 75.25,26.99 60.33,56.52 62.23,60.33 48.26,54.61 57.47,61.28 60.33,49.53 51.44,31.11 55.24,33.66
  pour Top (isolate 0.406): 1.27,73.91 1.27,1.27 76.83,0.95 76.83,73.6
  pour Top: 0.64,73.91 0.64,0.32 76.83,0.32 76.83,73.91
  pour Bottom (isolate 0.406): 1.27,73.91 1.27,1.27 76.52,1.27 76.52,73.91
HUM_DAT  (via drill 0.6)
  Top 0.254: R15.1 52.07,15.24 v50.8,16.51 | v56.52,11.43 IC2.2 | U1.100 46.99,45.72 46.99,26.67 v48.26,25.4
  Top 0.61: U1.64 U1.D2 U1.100
  Bottom 0.254: v50.8,16.51 50.8,11.11 51.44,10.48 55.88,10.48 56.52,11.11 v56.52,11.43
  Bottom 0.305: v50.8,16.51 49.53,16.51 48.26,17.78 v48.26,25.4
HUM_SCK  (via drill 0.6)
  Top 0.254: IC2.3 55.24,10.79 v54.61,11.43 | v53.34,16.51 54.61,15.29 R14.1 | U1.99 46.04,49.53 47.62,47.94 47.62,27.3 48.58,26.35 v49.53,26.35
  Top 0.61: U1.63 U1.D3 U1.99
  Bottom 0.254: v54.61,11.43 54.61,15.24 v53.34,16.51
  Bottom 0.305: v53.34,16.51 52.07,17.78 50.8,17.78 49.53,19.05 v49.53,26.35
I2C_SCL  (via drill 0.6, 0.7)
  Top 0.254: U9.10 65.96,42.55 65.09,42.55 64.45,43.18 v64.45,45.72 64.45,49.53 U8.10 | 50.8,24.77 50.8,26.67 49.53,27.94 v49.53,44.45 49.53,52.7 51.12,54.29 52.7,54.29 53.35,54.94 U4.P3
  Top 0.305: R7.1 44.13,20 48.9,24.77 50.8,24.77 57.47,24.77 58.42,23.81 58.42,21.59 JP14.2
  Top 0.406: U1.65 U1.D1 U1.101
  Bottom 0.254: 47.62,44.45 v49.53,44.45
  Bottom 0.305: U1.101 47.62,44.45 63.18,44.45 v64.45,45.72
I2C_SDA  (via drill 0.6)
  Top 0.254: U8.9 66.8,52.26 66.36,52.7 65.72,52.7 63.5,50.48 63.5,42.55 v64.14,41.91 64.77,41.27 66.36,41.27 66.8,41.72 U9.9 | U4.P2 52.7,55.24 52.39,54.93 50.8,54.93 48.58,52.7 v48.58,41.91
  Top 0.305: R6.1 48.26,16.51 49.53,17.78 52.07,17.78 JP14.6
  Top 0.406: U1.66 U1.D0 U1.102
  Bottom 0.254: U1.102 v48.58,41.91 | v48.58,41.91 v64.14,41.91 | 55.88,25.72 54.29,27.3 49.21,27.3 48.26,28.26 48.26,41.59 v48.58,41.91
  Bottom 0.305: 55.88,25.72 55.88,21.59 JP14.6
LOWBAT  (via drill 0.6)
  Top 0.254: R9.1 48.21,66.31 v47.94,66.04 | v50.16,55.88 51.9,55.88 U4.P1
  Bottom 0.254: v47.94,66.04 47.94,58.1 v50.16,55.88
N$1
  Top 0.254: Q1.3 R5.2 30.11,8.62 U2.1
N$2
  Top 0.305: L1.2 IC1.2 IC1.1 | D1.C 52.07,33.38 R1.2 57.05,31.48 L1.2 | L1.2 59.74,31.38 C3.1
N$3
  Top 0.254: R9.2 49.53,71.09 49.51,71.09 49.51,71.32 LED2.C
N$5
  Top 0.305: L2.1 D1.A 55.5,38.83 | 55.5,38.83 IC1.5 | C7.1 55.88,41.91 55.88,39.21 55.5,38.83
N$9
  Top 0.254: U3.5 58.1,48.95 R11.2
N$11
  Top 0.254: LED1.C R8.1
N$12
  Top 0.254: R10.1 64.77,60.96 63.5,62.23 SW1.1
  Top 0.305: Q2.1 62.55,63.19 63.5,62.23
N$16
  Top 0.254: U5.6 40.64,8.43 40.64,10.79 40.01,11.43 35.56,11.43 33.88,9.76 U2.3
  Top 0.406: 40.64,8.3 U5.6
PT+  (via drill 0.6)
  Top 0.254: U9.6 69.49,42.82 v70.17,43.5 | P1.9 73.26,41.59 v72.07,41.59 71.12,40.64 71.12,33.66 71.75,33.02 75.56,33.02 76.2,32.38 76.2,30.48 JP13.8
  Bottom 0.254: v70.17,43.5 v72.07,41.59
SDC_CD  (via drill 0.6)
  Top 0.254: 18.32,56.29 v18.41,56.2 17.68,56.93 U6.CD1 | v21.59,55.88 21.59,45.72 U1.11
  Top 0.61: U1.11 U1.A1 U1.47
  Bottom 0.254: v18.41,56.2 21.27,56.2 v21.59,55.88
SN1A
  Top 0.254: P1.7 73.61,46.04 71.75,46.04 71.12,45.4 71.12,43.18 67.82,39.88 U9.4 67.82,35.05 71.12,31.75 71.12,31.11 71.75,30.48 73.66,30.48 JP13.6
SN1W  (via drill 0.6)
  Top 0.254: P1.8 71.75,44.09 71.75,43.18 68.3,39.73 U9.5 68.3,35.84 v69.85,34.29
  Bottom 0.254: v69.85,34.29 JP13.5
SN2A
  Top 0.254: 76.2,35.56 76.2,45.72 74.93,46.99 P1.5 75.88,48.21 75.88,53.02 74.61,54.29 69.85,54.29 68.3,52.74 U8.6
  Top 0.305: 76.2,35.56 JP13.4
SN2W  (via drill 0.6)
  Top 0.254: U8.7 67.82,50.29 68.26,49.85 v71.44,49.85
  Bottom 0.254: v71.44,49.85 71.44,48.21 P1.6 72.71,46.99 73.66,46.04 73.66,35.56 JP13.3
SN3A
  Top 0.254: P1.3 74.66,48.94 73.66,47.94 71.12,47.94 68.9,45.72 68.26,45.72 67.82,46.16 U8.4
  Bottom 0.254: JP13.2 75.88,37.78 75.88,47.77 P1.3
SN3W  (via drill 0.6)
  Top 0.254: P1.4 72.56,48.9 70.8,48.9 68.94,47.03 U8.5 68.9,47.62 v68.9,48.58
  Bottom 0.254: JP13.1 69.22,40.01 69.22,48.26 v68.9,48.58
SPI_BAR_SS
  Top 0.254: Q1.1 27.67,13.85 R4.1 27.67,19.32 21.59,25.4 21.59,40.64 U1.12
  Top 0.61: U1.12 U1.A0 U1.48
SPI_FREE_SS  (via drill 0.6)
  Top 0.254: JP9.2 7.62,52.07 9.53,52.07 v10.79,50.8 10.79,49.53 9.79,48.53 R2.1
  Top 0.61: U1.62 U1.D4 U1.98
  Bottom 0.305: U1.62 39.37,50.8 v10.79,50.8
SPI_MISO  (via drill 0.6)
  Top 0.254: U5.8 38.03,6.42 v38.1,6.35 | U6.7 17.29,67.81 17.78,67.31
  Top 0.305: 17.78,67.31 v17.78,60.64
  Top 0.61: U1.8 U1.A4 U1.44
  Bottom 0.254: v38.1,6.35 41.91,6.35 43.18,5.08 43.18,1.91 42.23,0.95 30.8,0.95 10.16,21.59 10.16,35.56 11.43,36.83 11.43,41.91 8.89,44.45 JP9.3
  Bottom 0.305: U1.8 10.16,52.07 JP9.3 11.43,55.88 15.24,55.88 17.78,58.42 v17.78,60.64
SPI_MOSI  (via drill 0.6)
  Top 0.254: U1.7 23.32,54.61 | 23.32,54.61 24.13,54.61 | 23.32,54.63 23.32,54.61 | v18.41,53.34 v18.41,39.37 | U6.3 12.88,65.91 10.16,63.18
  Top 0.305: JP9.4 11.43,54.61 10.16,55.88 10.16,63.18
  Top 0.406: U5.7 39.28,10.07 v39.05,10.48
  Top 0.61: U1.7 U1.A5 U1.43
  Bottom 0.254: U1.7 21.59,53.34 v18.41,53.34 | v18.41,39.37 18.41,24.77 33.02,10.48 v39.05,10.48
  Bottom 0.305: U1.7 12.7,54.61 JP9.4
SPI_SCK  (via drill 0.6)
  Top 0.254: JP9.5 13.97,50.8 v15.24,49.53 | U5.1 36.67,3.02 v35.88,3.81 | U6.5 15.09,65.89 13.97,64.77
  Top 0.305: JP9.5 13.97,64.77
  Top 0.61: U1.9 U1.A3 U1.45
  Bottom 0.254: U1.9 v15.24,49.53 13.97,49.53 12.7,48.26 12.7,21.59 30.48,3.81 v35.88,3.81
SPI_SDC_SS  (via drill 0.6)
  Top 0.254: 7.99,61.96 7.99,56.78 10.16,54.61 10.16,52.7 v14.61,48.26 | U6.2 11.79,65.76 11.75,65.72
  Top 0.305: R3.1 7.99,61.96 11.75,65.72
  Top 0.61: U1.46 U1.A2 U1.10
  Bottom 0.254: v14.61,48.26 21.59,48.26 U1.10
VIN_MCU  (via drill 0.6)
  Top 0.254: D2.C 53.88,47.53 | 53.88,47.53 54.61,48.26 54.61,50.45 U3.4 55.91,52.04 v54.93,53.02 | C8.1 56.01,45.4 53.88,47.53
  Top 0.305: v50.8,71.75 51.02,71.75 LED1.A | D2.C L2.2 | C8.1 56.3,44.66 57.15,43.81 59.05,43.81 59.69,43.18 v59.69,39.69
  Bottom 0.254: v59.69,39.69 59.69,31.75 72.39,19.05 JP8.3 | U1.37 37.47,69.85 40.64,73.03 49.53,73.03 v50.8,71.75 | v54.93,53.02 50.8,57.15
  Bottom 0.305: 50.8,57.15 v50.8,71.75
  Bottom 0.406: U1.1 U1.VIN U1.37
VOC_AIN  (via drill 0.6)
  Top 0.254: U9.7 67.82,44.01
  Top 0.305: 67.82,44.01 v68.26,44.45 | JP14.1 60.96,22.86 62.23,24.13 68.58,24.13 72.39,27.94 JP13.7
  Bottom 0.254: v68.26,44.45 68.58,44.13 68.58,34.29 71.12,31.75 71.12,30.48 JP13.7
VOC_PIO  (via drill 0.6)
  Top 0.254: JP14.5 53.34,21.59 v46.99,21.59
  Top 0.406: U1.6 U1.DAC U1.42
  Bottom 0.254: v46.99,21.59 44.45,24.13 44.45,25.4
  Bottom 0.305: U1.42 35.56,57.15 39.37,53.34 41.27,53.34 41.91,52.7 41.91,43.81 42.55,43.18 43.81,43.18 44.45,42.55 44.45,25.4

### Text on the board
tPlace: SWTC | CLMP | RAW | UCSD MetaSense / Boardv2.1 | 3V | 5V | MCU | G